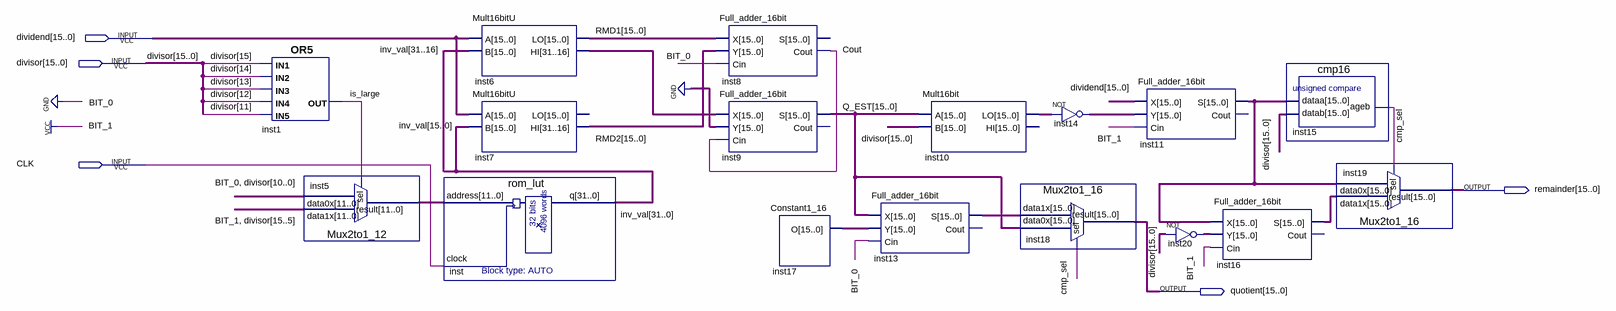
[diagram p0: schematic sheet]
// Quartus schematic Div16o.bdf as structural Verilog: 17 symbols, 5 pins
module Div16o (
  input  [15:0] dividend,
  input  [15:0] divisor,
  input  CLK,
  output [15:0] remainder,
  output [15:0] quotient
);

  wire cmp_sel, Cout, is_large;
  wire [11:0] inst5_result;
  wire [15:0] inst6_hi, inst10_lo, inst11_s, inst13_s, inst14_out, inst16_s, inst17_o, inst20_out, Q_EST,
       RMD1, RMD2;
  wire [31:0] inv_val;

  or inst1 (is_large, divisor[15], divisor[14], divisor[13], divisor[12], divisor[11]);
  Mux2to1_12 inst5 (
    .data1x({1'b1, divisor[15:5]}), .data0x({1'b0, divisor[10:0]}), .sel(is_large), .result(inst5_result));
  rom_lut inst (.address(inst5_result), .clock(CLK), .q(inv_val));
  Mult16bitU inst6 (.A(dividend), .B(inv_val[31:16]), .HI(inst6_hi), .LO(RMD1));
  Mult16bitU inst7 (.A(dividend), .B(inv_val[15:0]), .HI(RMD2));  // open: LO
  Full_adder_16bit inst8 (.X(RMD1), .Y(RMD2), .Cin(1'b0), .Cout(Cout));  // open: S
  Full_adder_16bit inst9 (.X(inst6_hi), .Y({16{1'b0}}), .Cin(Cout), .S(Q_EST));  // open: Cout
  Constant1_16 inst17 (.O(inst17_o));
  Full_adder_16bit inst13 (.X(Q_EST), .Y(inst17_o), .Cin(1'b0), .S(inst13_s));  // open: Cout
  Mult16bit inst10 (.A(Q_EST), .B(divisor), .LO(inst10_lo));  // open: HI
  assign inst14_out = ~inst10_lo;  // NOT inst14, 16 bits wide
  Mux2to1_16 inst18 (.data1x(inst13_s), .data0x(Q_EST), .sel(cmp_sel), .result(quotient));
  Full_adder_16bit inst11 (.X(dividend), .Y(inst14_out), .Cin(1'b1), .S(inst11_s));  // open: Cout
  Full_adder_16bit inst16 (.X(inst11_s), .Y(inst20_out), .Cin(1'b1), .S(inst16_s));  // open: Cout
  assign inst20_out = ~divisor;  // NOT inst20, 16 bits wide
  cmp16 inst15 (.dataa(inst11_s), .datab(divisor), .ageb(cmp_sel));
  Mux2to1_16 inst19 (.data1x(inst16_s), .data0x(inst11_s), .sel(cmp_sel), .result(remainder));
endmodule
